# Altium schematic sheet Schematic of Schematics.SCHDOC
size A4
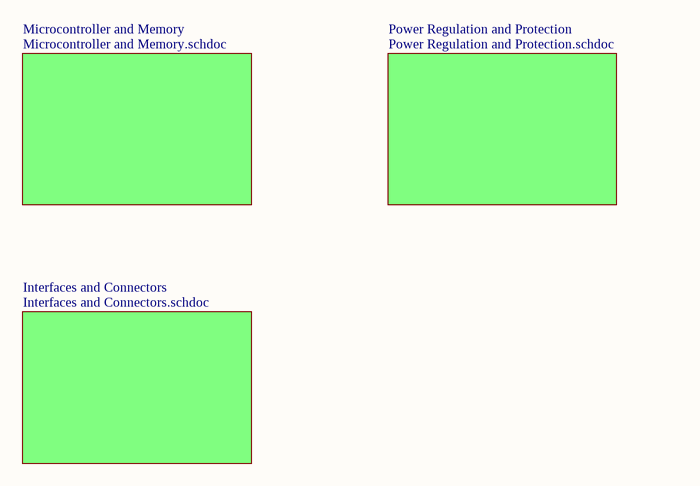
[diagram p0: Schematic of Schematics.SCHDOC]

## Sub-sheets
Interfaces and Connectors = Interfaces and Connectors.schdoc: no entries
Microcontroller and Memory = Microcontroller and Memory.schdoc: no entries
Power Regulation and Protection = Power Regulation and Protection.schdoc: no entries